# EAGLE design robo_contato (EAGLE 9.6.2)
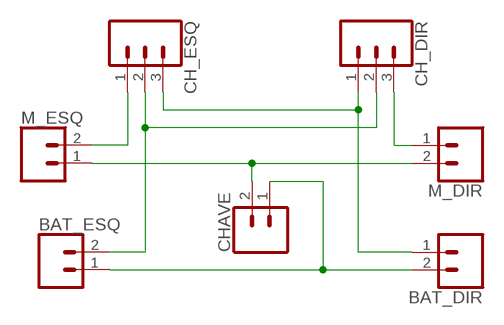
[diagram p0: schematic, sheet 1]

## Parts
BAT_DIR  CONN_02  [1X02]
BAT_ESQ  CONN_02  [1X02]
CH_DIR  CONN_03  [1X03]
CH_ESQ  CONN_03  [1X03]
CHAVE  CONN_02  [1X02]
M_DIR  CONN_02  [1X02]
M_ESQ  CONN_02  [1X02]

## Nets
N$1: BAT_ESQ.2 CH_DIR.2 CH_ESQ.2
N$2: CHAVE.2 M_DIR.2 M_ESQ.1
N$3: BAT_DIR.1 CH_DIR.1 CH_ESQ.3
N$4: CH_DIR.3 M_DIR.1
N$5: CH_ESQ.1 M_ESQ.2
N$6: BAT_DIR.2 BAT_ESQ.1 CHAVE.1

## Library data of the parts
BAT_DIR BAT_ESQ CHAVE M_DIR M_ESQ = SparkFun-Connectors:CONN_02: Multi connection point. Often used as Generic Header-pin footprint for 0.1 inch spaced/style header connections On any of the 0.1 inch spaced packages, you can populate with these: Break Away Headers - Straight <https://www.sparkfun.com/products/116> (PRT-00116) Break Away Male Headers - Right Angle <https://www.sparkfun.com/products/553> (PRT-00553) Female Headers <https://www.sparkfun.com/products/115> (PRT-00115) Break Away Headers - Machine Pin <https://www.sparkfun.com/products/117> (PRT-00117) Break Away Female Headers - Swiss Machine Pin <https://www.sparkfun.com/products/743> (PRT-00743) For SCREWTERMINALS and SPRING TERMINALS visit here: Screw Terimnals on SparkFun.com <https://www.sparkfun.com/search/results?term=Screw+Terminals> (5mm/3.5mm/2.54mm spacing) This device is also useful as a general connection point to wire up your design to another part of your project. Our various solder wires solder well into these plated through hole pads. Hook-Up Wire - Assortment (Stranded, 22 AWG) <https://www.sparkfun.com/products/11375> (PRT-11375) Hook-Up Wire - Assortment (Solid Core, 22 AWG) <https://www.sparkfun.com/products/11367> (PRT-11367) View the entire wire category on our website here <https://www.sparkfun.com/categories/141> Special notes: Molex polarized connector foot print use with: PRT-08233 with associated crimp pins and housings. 2.54_SCREWTERM for use with PRT-10571. 3.5mm Screw Terminal footprints for PRT-08084 5mm Screw Terminal footprints for use with PRT-08432
CH_DIR CH_ESQ = SparkFun-Connectors:CONN_03: Multi connection point. Often used as Generic Header-pin footprint for 0.1 inch spaced/style header connections On any of the 0.1 inch spaced packages, you can populate with these: Break Away Headers - Straight <https://www.sparkfun.com/products/116> (PRT-00116) Break Away Male Headers - Right Angle <https://www.sparkfun.com/products/553> (PRT-00553) Female Headers <https://www.sparkfun.com/products/115> (PRT-00115) Break Away Headers - Machine Pin <https://www.sparkfun.com/products/117> (PRT-00117) Break Away Female Headers - Swiss Machine Pin <https://www.sparkfun.com/products/743> (PRT-00743) Stackable Header - 3 Pin (Female, 0.1") <https://www.sparkfun.com/products/13875> (PRT-13875) For SCREWTERMINALS and SPRING TERMINALS visit here: Screw Terimnals on SparkFun.com <https://www.sparkfun.com/search/results?term=Screw+Terminals> (5mm/3.5mm/2.54mm spacing) This device is also useful as a general connection point to wire up your design to another part of your project. Our various solder wires solder well into these plated through hole pads. Hook-Up Wire - Assortment (Stranded, 22 AWG) <https://www.sparkfun.com/products/11375> (PRT-11375) Hook-Up Wire - Assortment (Solid Core, 22 AWG) <https://www.sparkfun.com/products/11367> (PRT-11367) View the entire wire category on our website here <https://www.sparkfun.com/categories/141> Special notes: Molex polarized connector foot print use with SKU : PRT-08232 with associated crimp pins and housings.

## Board
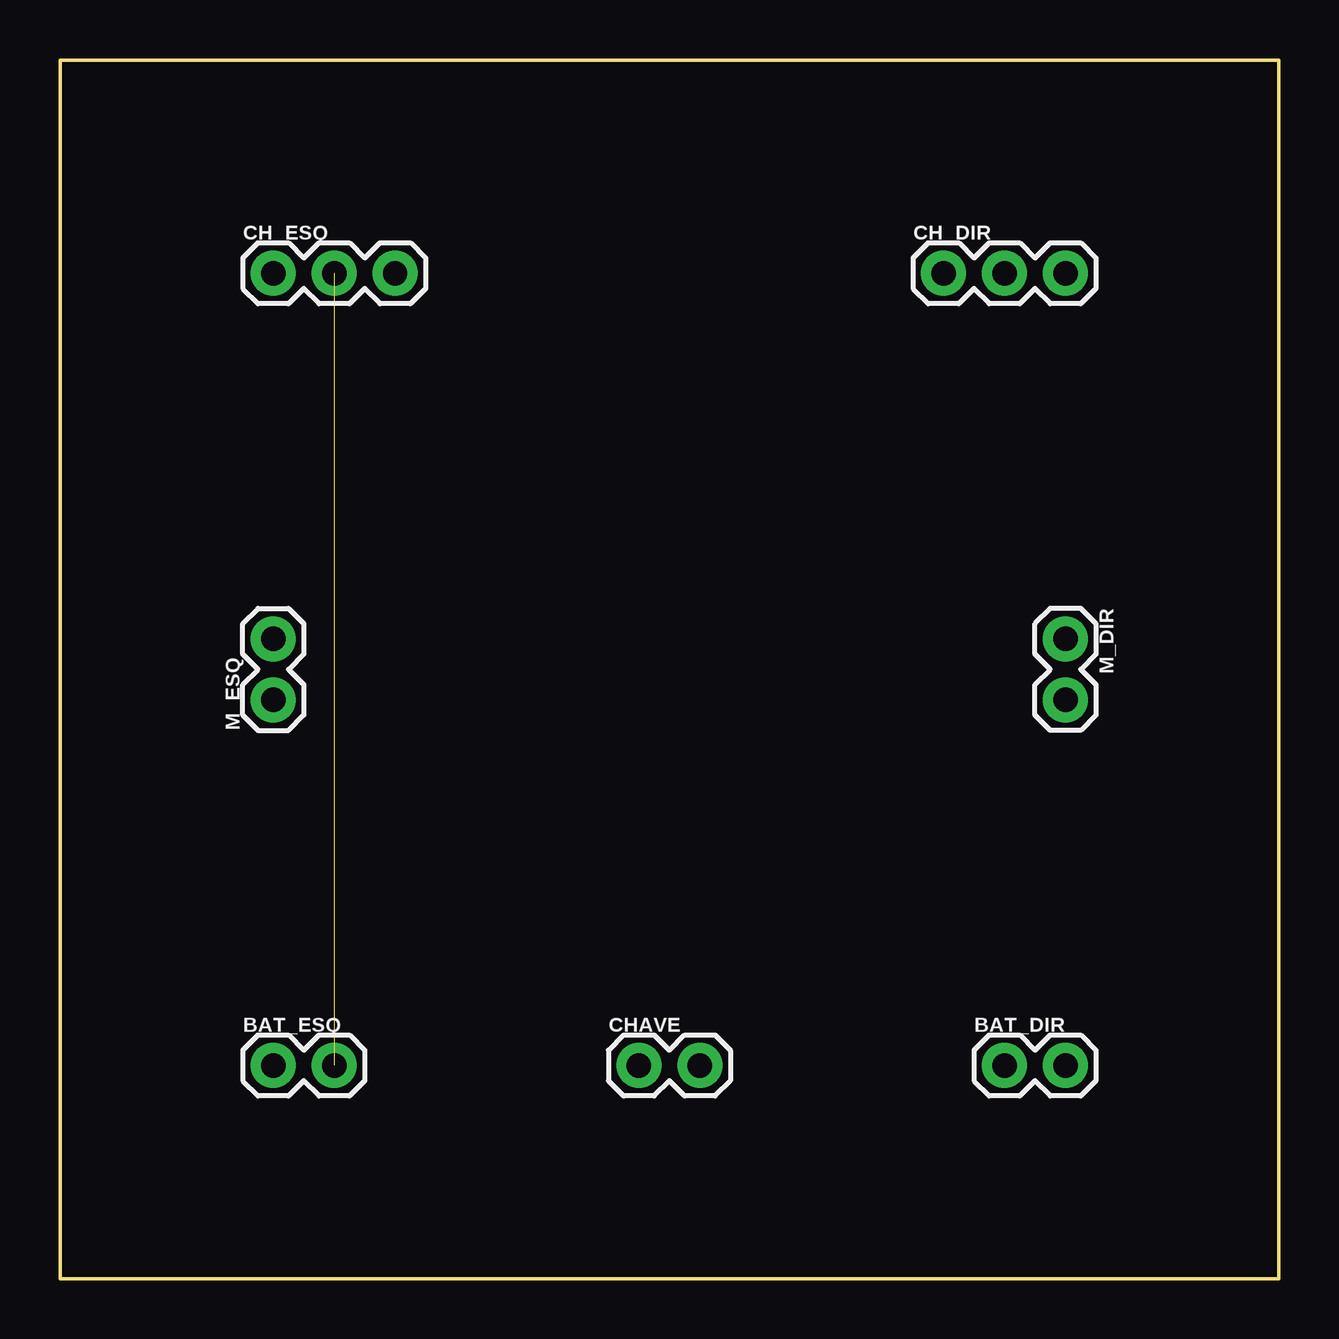
[diagram p1: board, top side]
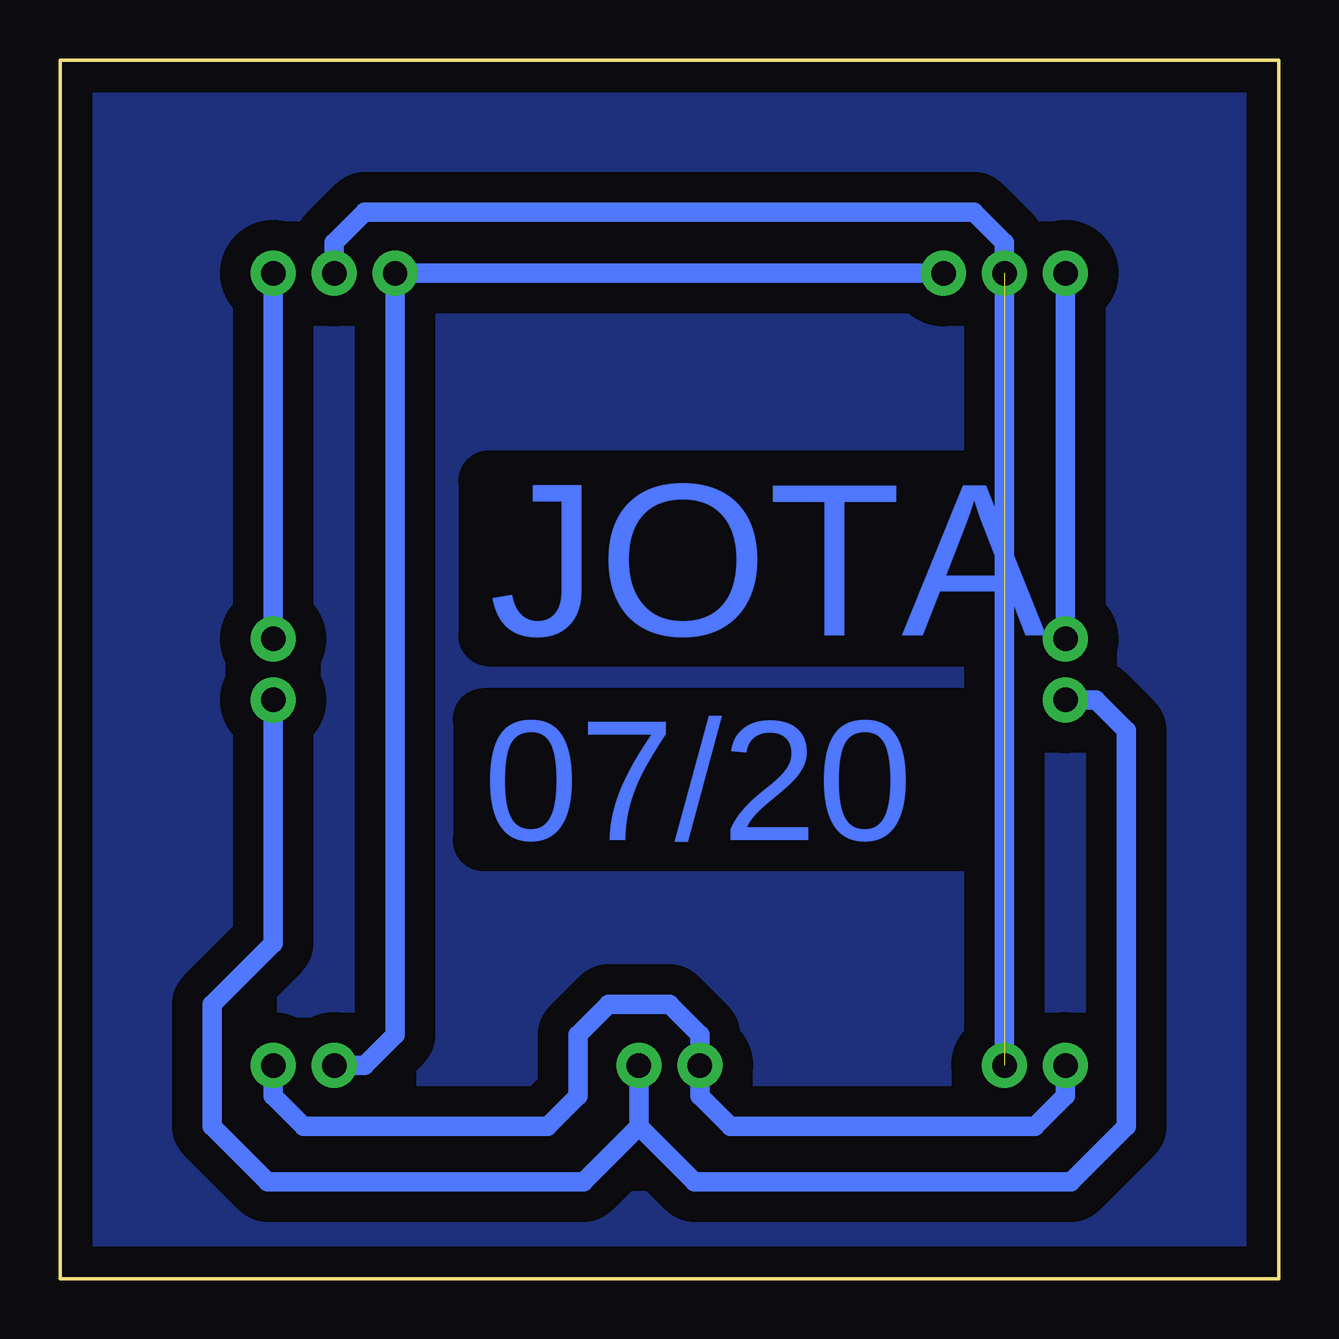
[diagram p2: board, bottom side, seen from below]

Size 50.8 x 50.8 mm. Coordinates in mm from the lower left corner, seen from the top.
Outline: 0,0 50.8,0 50.8,50.8 0,50.8 0,0
Copper layers (1*16): Top 0.035mm / dielectric 1.5mm / Bottom 0.035mm
Design rules "default": minimum track width 6mil, minimum drill 0.35mm, track to track 6mil, track to pad 6mil, pad to pad 6mil, via to via 6mil, smd to smd 6mil, copper to edge 40mil, drill to drill 6mil, minimum pad ring 10mil, minimum via ring 8mil, stop-mask expansion 4mil, vias tented up to drill 0mil, thermal gap 10mil

### Footprints (pad centres in the part's own frame; a part is rotated, then mirrored left to right if it is on the bottom)
1X02 = drill 1.016 pad 1.88: 1 0,0; 2 2.54,0
1X03 = drill 1.016 pad 1.88: 1 0,0; 2 2.54,0; 3 5.08,0

### Placement (x,y rotation side)
BAT_DIR  39.37,8.89 0 top
BAT_ESQ  8.89,8.89 0 top
CH_DIR  36.83,41.91 0 top
CH_ESQ  8.89,41.91 0 top
CHAVE  24.13,8.89 0 top
M_DIR  41.91,26.67 270 top
M_ESQ  8.89,24.13 90 top

### Tracks (layer width: path | path; a pad name or v marks a point on that pad's centre or on a via)
GND
  pour Bottom (isolate 1.27): -0.03,-0.05 0.15,0.13 50.8,0.13 50.72,0.2 50.72,50.83 0.08,50.83 0.08,0.05
N$1  (1 unrouted)
  Bottom 0.813: BAT_ESQ.2 CH_ESQ.2 11.43,43.18 12.7,44.45 38.1,44.45 39.37,43.18 CH_DIR.2
N$2
  Bottom 0.813: M_ESQ.1 7.62,24.13 6.35,22.86 6.35,6.35 8.66,4.04 24.36,4.04 26.67,6.35 | 26.67,6.35 CHAVE.2 | 26.67,6.35 28.98,4.04 42.14,4.04 44.45,6.35 44.45,11.43 41.91,13.97 M_DIR.2
N$3
  Bottom 0.813: CH_ESQ.3 CH_DIR.1 36.83,10.16 38.1,8.89 BAT_DIR.1
N$4
  Bottom 0.813: M_DIR.1 CH_DIR.3
N$5
  Bottom 0.813: M_ESQ.2 CH_ESQ.1
N$6
  Bottom 0.813: BAT_ESQ.1 8.89,7.62 10.16,6.35 22.86,6.35 24.13,7.62 CHAVE.1 24.13,10.16 25.4,11.43 27.94,11.43 29.21,10.16 29.21,7.62 30.48,6.35 40.64,6.35 41.91,7.62 BAT_DIR.2

### Text on the board
Bottom: JOTA | 07/20